# EAGLE schematic RGB Interconnect cable (EAGLE 7.7.0)
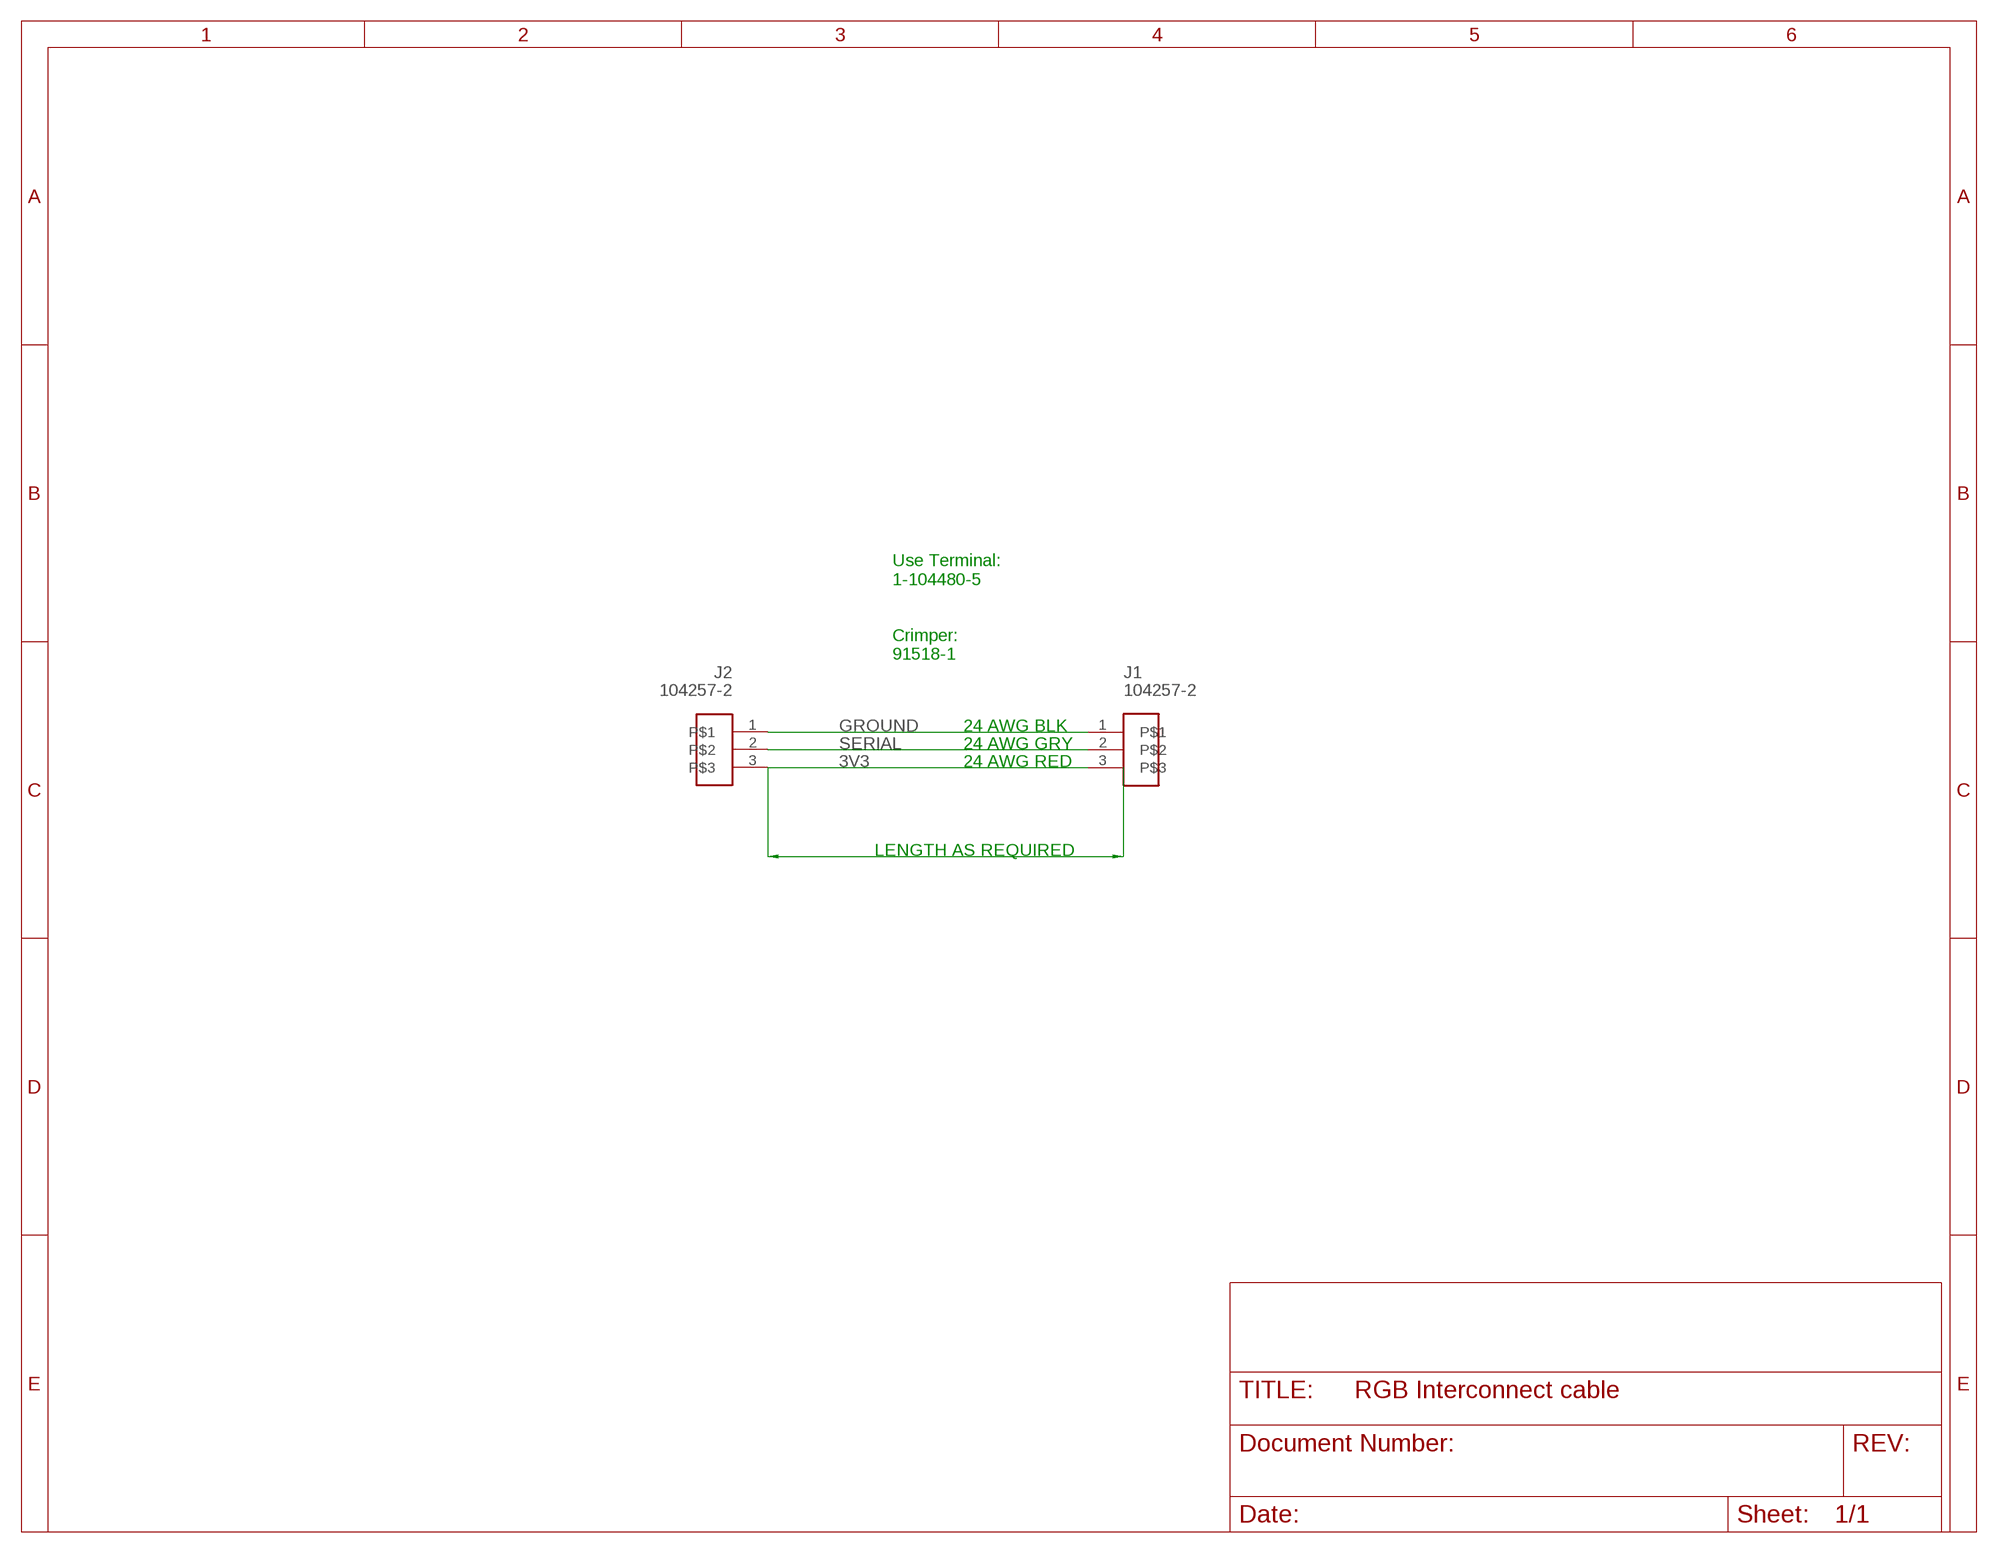
[diagram p0: schematic, sheet 1]

## Parts
J1  104257-2  CON3AMPMODU-3  [AMPMODU-3]
J2  104257-2  CON3AMPMODU-3  [AMPMODU-3]

## Nets
3V3: J1.3 J2.3
GROUND: J1.1 J2.1
SERIAL: J1.2 J2.2

## Notes on the sheet
- Use Terminal: 
  1-104480-5
  
  
  Crimper:
  91518-1
- 24 AWG BLK
- 24 AWG GRY
- 24 AWG RED
- LENGTH AS REQUIRED

## Library data of the parts
J1 J2 = STEVES_BU:CON3